# Altium schematic sheet Main.SchDoc
size A
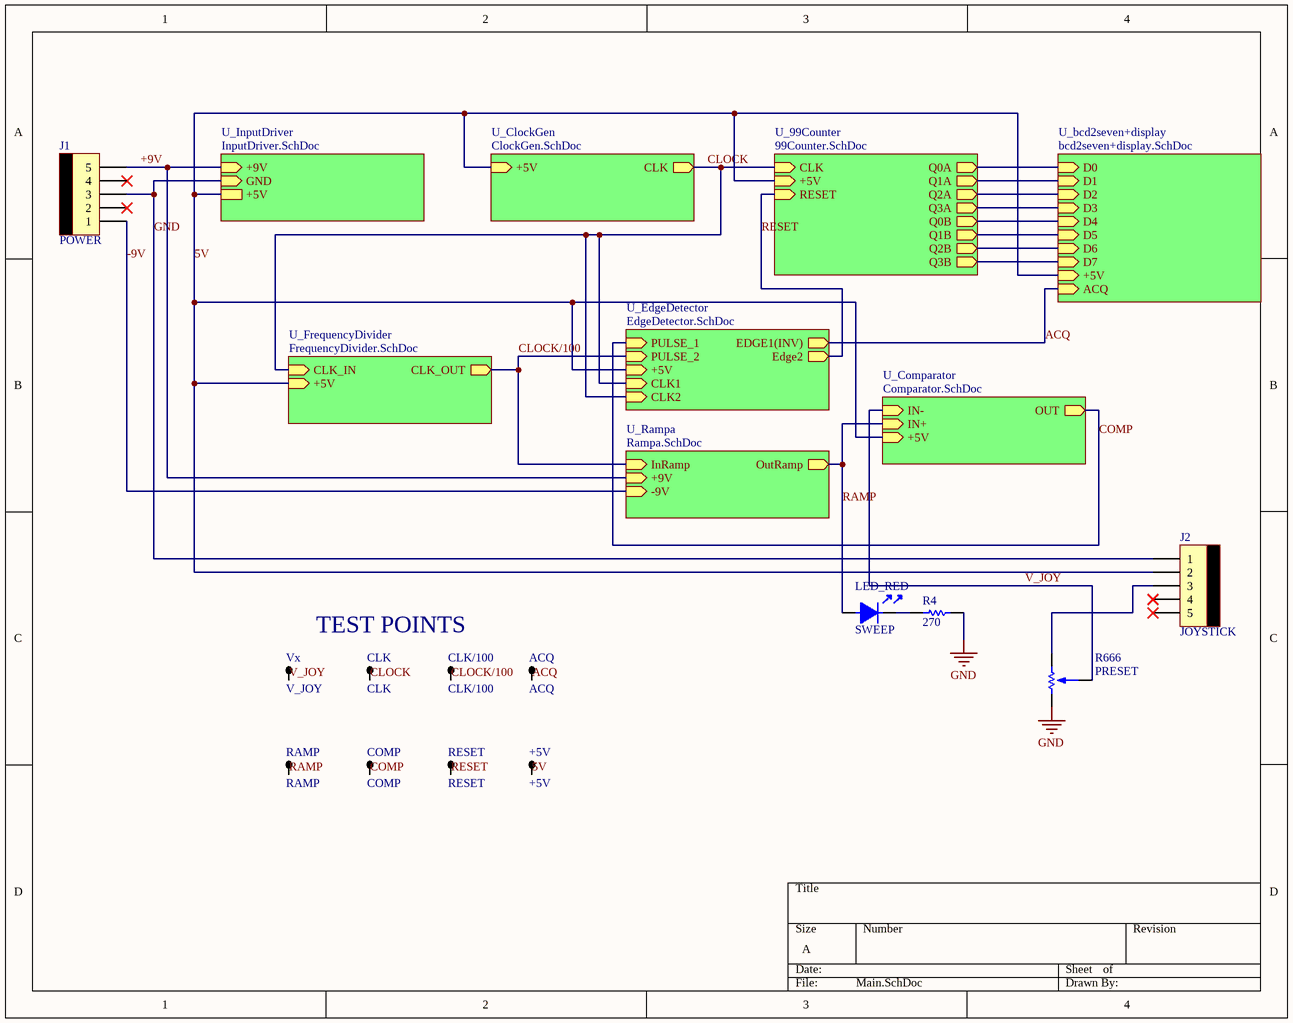
[diagram p0: Main.SchDoc]

## Parts
+5V  +5V  [TPTH]
ACQ  ACQ  [TPTH]
CLK  CLK  [TPTH]
CLK/100  CLK/100  [TPTH]
COMP  COMP  [TPTH]
J1  POWER  [MOLEX5]
J2  JOYSTICK  [MOLEX5]
LED_RED  SWEEP  [LED3]
R4  270  [0805]
R666  PRESET  [PRESET V]
RAMP  RAMP  [TPTH]
RESET  RESET  [TPTH]
Vx  V_JOY  [TPTH]

## Sub-sheets
U_99Counter = 99Counter.SchDoc: CLK (in), +5V (in), RESET (in), Q0A (out), Q1A (out), Q2A (out), Q3A (out), Q0B (out), Q1B (out), Q2B (out), Q3B (out)
U_bcd2seven+display = bcd2seven+display.SchDoc: D0 (in), D1 (in), D2 (in), D3 (in), D4 (in), D5 (in), D6 (in), D7 (in), +5V (in), ACQ (in)
U_ClockGen = ClockGen.SchDoc: +5V (in), CLK (out)
U_Comparator = Comparator.SchDoc: IN- (in), IN+ (in), OUT (out), +5V (in)
U_EdgeDetector = EdgeDetector.SchDoc: Edge2 (out), +5V (in), EDGE1(INV) (out), PULSE_1 (in), PULSE_2 (in), CLK1 (in), CLK2 (in)
U_FrequencyDivider = FrequencyDivider.SchDoc: CLK_IN (in), +5V (in), CLK_OUT (out)
U_InputDriver = InputDriver.SchDoc: +9V (in), GND (in), +5V
U_Rampa = Rampa.SchDoc: InRamp (in), OutRamp (out), +9V (in), -9V (in)

## Nets
GND: J1.3 J2.1 R4.2 R666.3 ; sheet U_InputDriver/GND
5V: +5V.1 J2.2 ; sheet U_InputDriver/+5V, sheet U_ClockGen/+5V, sheet U_99Counter/+5V, sheet U_bcd2seven+display/+5V, sheet U_FrequencyDivider/+5V, sheet U_EdgeDetector/+5V, sheet U_Comparator/+5V
+9V: J1.5 ; sheet U_InputDriver/+9V, sheet U_Rampa/+9V
-9V: J1.1 ; sheet U_Rampa/-9V
ACQ: ACQ.1 ; sheet U_bcd2seven+display/ACQ, sheet U_EdgeDetector/EDGE1(INV)
CLOCK: CLK.1 ; sheet U_ClockGen/CLK, sheet U_99Counter/CLK, sheet U_FrequencyDivider/CLK_IN, sheet U_EdgeDetector/CLK1, sheet U_EdgeDetector/CLK2
CLOCK/100: CLK/100.1 ; sheet U_FrequencyDivider/CLK_OUT, sheet U_EdgeDetector/PULSE_2, sheet U_Rampa/InRamp
COMP: COMP.1 ; sheet U_EdgeDetector/PULSE_1, sheet U_Comparator/OUT
RAMP: LED_RED.1 RAMP.1 ; sheet U_Rampa/OutRamp, sheet U_Comparator/IN+
RESET: RESET.1 ; sheet U_99Counter/RESET, sheet U_EdgeDetector/Edge2
V_JOY: R666.2 Vx.1 ; sheet U_Comparator/IN-
NetJ2_3: J2.3 R666.1
NetLED_RED_2: LED_RED.2 R4.1
(unnamed): sheet U_99Counter/Q0A, sheet U_bcd2seven+display/D0
(unnamed): sheet U_99Counter/Q1A, sheet U_bcd2seven+display/D1
(unnamed): sheet U_99Counter/Q2A, sheet U_bcd2seven+display/D2
(unnamed): sheet U_99Counter/Q3A, sheet U_bcd2seven+display/D3
(unnamed): sheet U_99Counter/Q0B, sheet U_bcd2seven+display/D4
(unnamed): sheet U_99Counter/Q1B, sheet U_bcd2seven+display/D5
(unnamed): sheet U_99Counter/Q2B, sheet U_bcd2seven+display/D6
(unnamed): sheet U_99Counter/Q3B, sheet U_bcd2seven+display/D7

Not connected (* = marked no-connect by the designer): J1 2* 4*; J2 4* 5*

## Notes on the sheet
- TEST POINTS

## Library data of the parts
+5V ACQ CLK CLK/100 COMP RAMP RESET Vx = TP
J1 J2 = MOLEX5
LED_RED = LED
R4 = RES